# Altium schematic sheet fpga23-serdes-power.SchDoc
size Tabloid; SheetNumber: 52; SheetTotal: 71
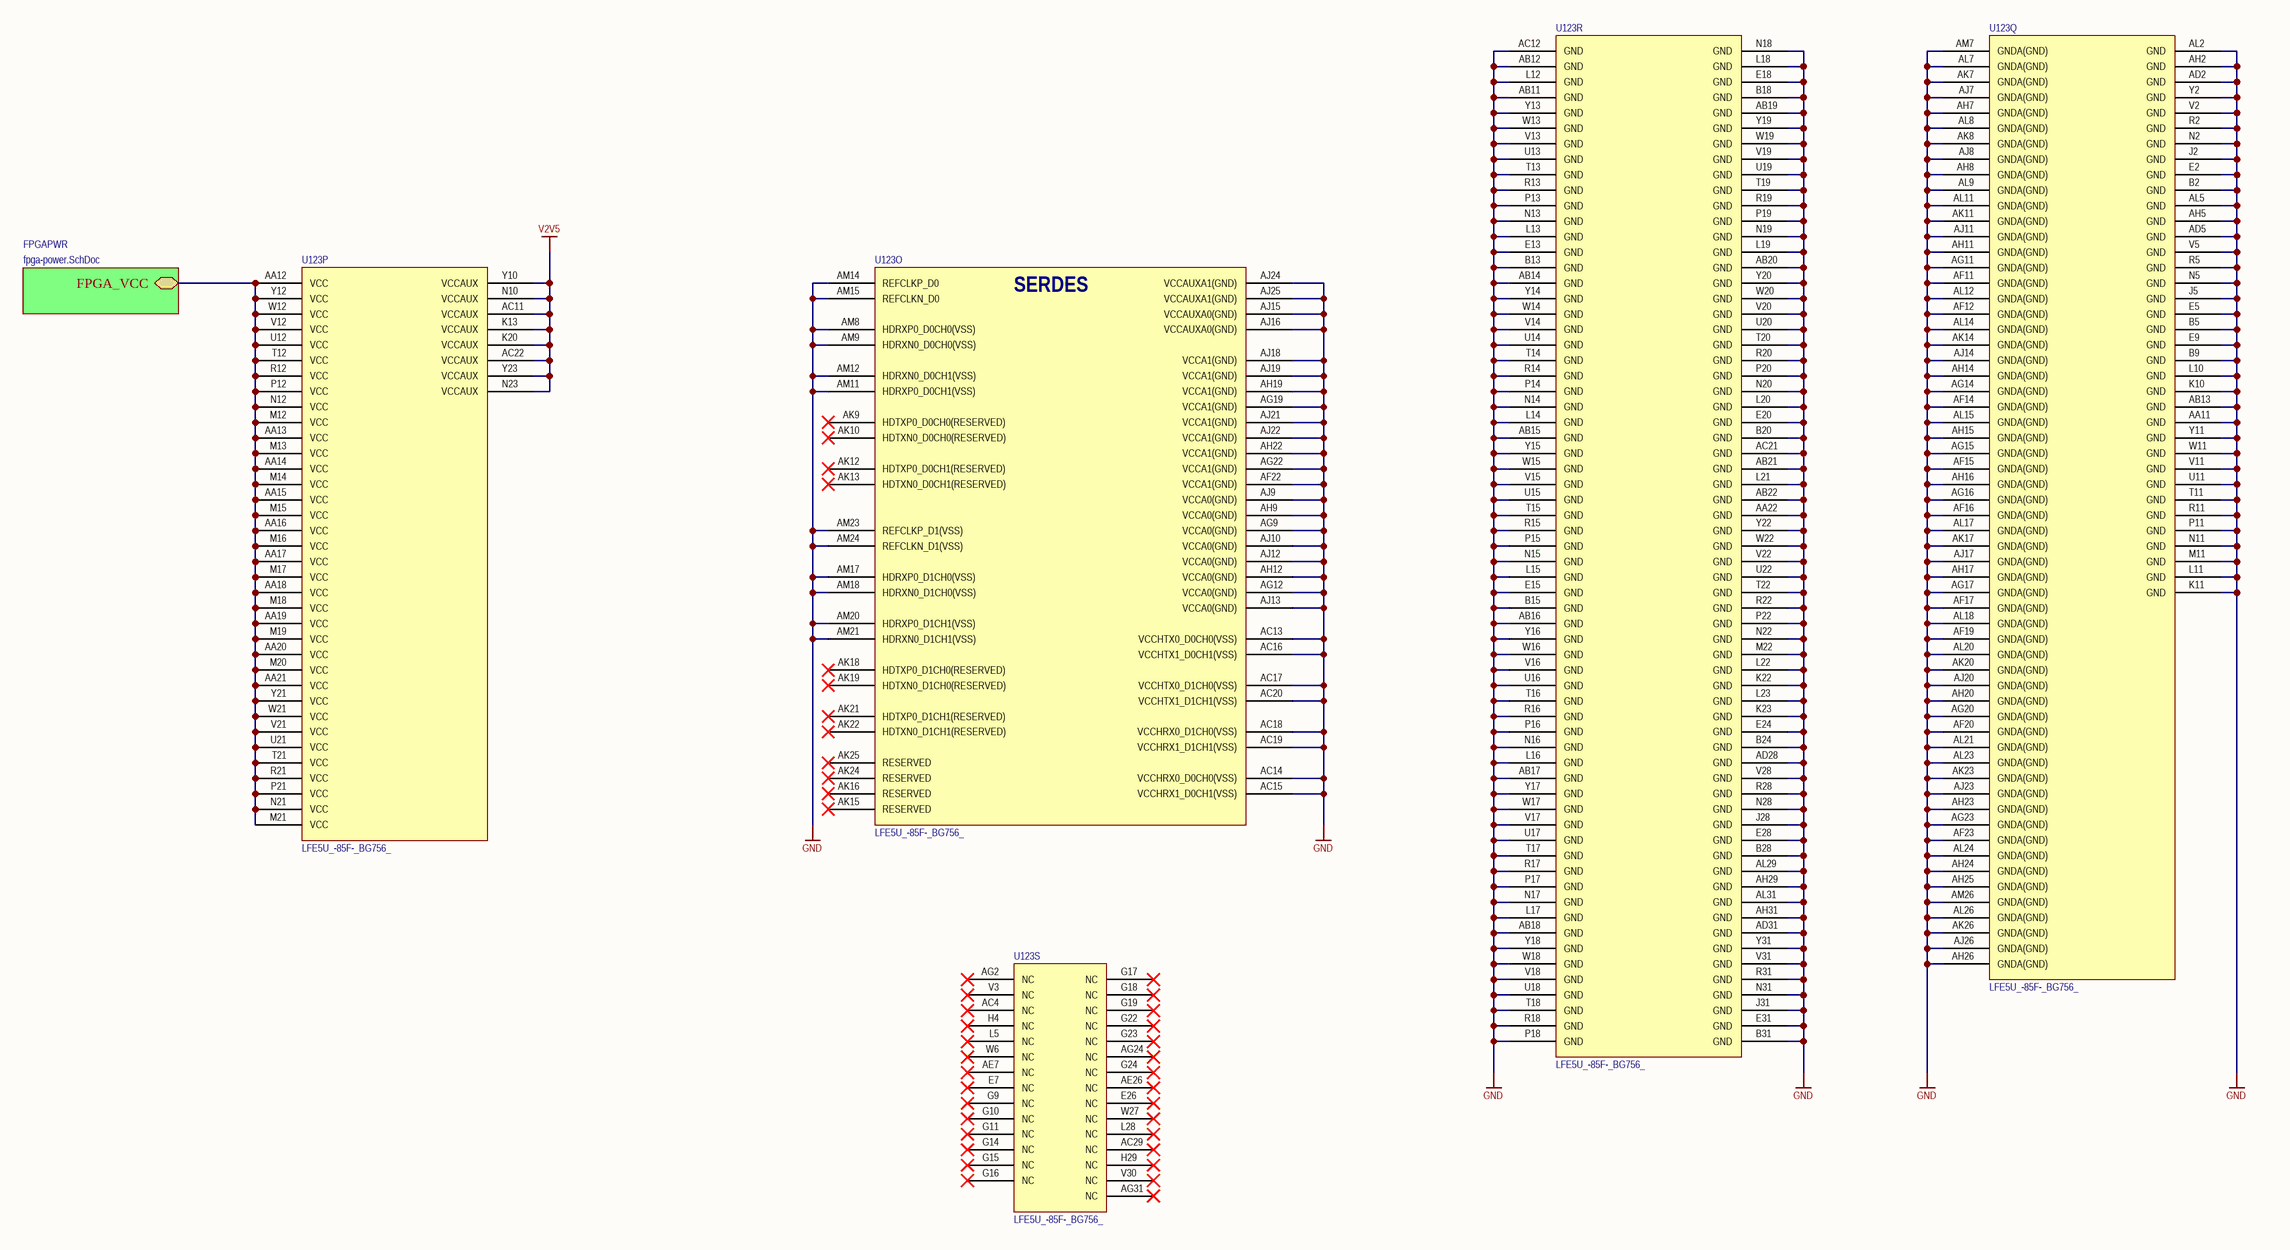
[diagram p0: fpga23-serdes-power.SchDoc]

## Parts
U123  LFE5U_-85F-_BG756_  [caBGA756]  (parts O,P,Q,R,S of 19)

## Sub-sheets
FPGAPWR = fpga-power.SchDoc: FPGA_VCC

## Nets
GND: U123.AA11(GND) U123.AA22(GND) U123.AB11(GND) U123.AB12(GND) U123.AB13(GND) U123.AB14(GND) U123.AB15(GND) U123.AB16(GND) U123.AB17(GND) U123.AB18(GND) U123.AB19(GND) U123.AB20(GND) U123.AB21(GND) U123.AB22(GND) U123.AC12(GND) U123.AC13(VCCHTX0_D0CH0(VSS)) U123.AC14(VCCHRX0_D0CH0(VSS)) U123.AC15(VCCHRX1_D0CH1(VSS)) U123.AC16(VCCHTX1_D0CH1(VSS)) U123.AC17(VCCHTX0_D1CH0(VSS)) U123.AC18(VCCHRX0_D1CH0(VSS)) U123.AC19(VCCHRX1_D1CH1(VSS)) U123.AC20(VCCHTX1_D1CH1(VSS)) U123.AC21(GND) U123.AD2(GND) U123.AD5(GND) U123.AD28(GND) U123.AD31(GND) U123.AF11(GNDA(GND)) U123.AF12(GNDA(GND)) U123.AF14(GNDA(GND)) U123.AF15(GNDA(GND)) U123.AF16(GNDA(GND)) U123.AF17(GNDA(GND)) U123.AF19(GNDA(GND)) U123.AF20(GNDA(GND)) U123.AF22(VCCA1(GND)) U123.AF23(GNDA(GND)) U123.AG9(VCCA0(GND)) U123.AG11(GNDA(GND)) U123.AG12(VCCA0(GND)) U123.AG14(GNDA(GND)) U123.AG15(GNDA(GND)) U123.AG16(GNDA(GND)) U123.AG17(GNDA(GND)) U123.AG19(VCCA1(GND)) U123.AG20(GNDA(GND)) U123.AG22(VCCA1(GND)) U123.AG23(GNDA(GND)) U123.AH2(GND) U123.AH5(GND) U123.AH7(GNDA(GND)) U123.AH8(GNDA(GND)) U123.AH9(VCCA0(GND)) U123.AH11(GNDA(GND)) U123.AH12(VCCA0(GND)) U123.AH14(GNDA(GND)) U123.AH15(GNDA(GND)) U123.AH16(GNDA(GND)) U123.AH17(GNDA(GND)) U123.AH19(VCCA1(GND)) U123.AH20(GNDA(GND)) U123.AH22(VCCA1(GND)) U123.AH23(GNDA(GND)) U123.AH24(GNDA(GND)) U123.AH25(GNDA(GND)) U123.AH26(GNDA(GND)) U123.AH29(GND) U123.AH31(GND) U123.AJ7(GNDA(GND)) U123.AJ8(GNDA(GND)) U123.AJ9(VCCA0(GND)) U123.AJ10(VCCA0(GND)) U123.AJ11(GNDA(GND)) U123.AJ12(VCCA0(GND)) U123.AJ13(VCCA0(GND)) U123.AJ14(GNDA(GND)) U123.AJ15(VCCAUXA0(GND)) U123.AJ16(VCCAUXA0(GND)) U123.AJ17(GNDA(GND)) U123.AJ18(VCCA1(GND)) U123.AJ19(VCCA1(GND)) U123.AJ20(GNDA(GND)) U123.AJ21(VCCA1(GND)) U123.AJ22(VCCA1(GND)) U123.AJ23(GNDA(GND)) U123.AJ24(VCCAUXA1(GND)) U123.AJ25(VCCAUXA1(GND)) U123.AJ26(GNDA(GND)) U123.AK7(GNDA(GND)) U123.AK8(GNDA(GND)) U123.AK11(GNDA(GND)) U123.AK14(GNDA(GND)) U123.AK17(GNDA(GND)) U123.AK20(GNDA(GND)) U123.AK23(GNDA(GND)) U123.AK26(GNDA(GND)) U123.AL2(GND) U123.AL5(GND) U123.AL7(GNDA(GND)) U123.AL8(GNDA(GND)) U123.AL9(GNDA(GND)) U123.AL11(GNDA(GND)) U123.AL12(GNDA(GND)) U123.AL14(GNDA(GND)) U123.AL15(GNDA(GND)) U123.AL17(GNDA(GND)) U123.AL18(GNDA(GND)) U123.AL20(GNDA(GND)) U123.AL21(GNDA(GND)) U123.AL23(GNDA(GND)) U123.AL24(GNDA(GND)) U123.AL26(GNDA(GND)) U123.AL29(GND) U123.AL31(GND) U123.AM7(GNDA(GND)) U123.AM8(HDRXP0_D0CH0(VSS)) U123.AM9(HDRXN0_D0CH0(VSS)) U123.AM11(HDRXP0_D0CH1(VSS)) U123.AM12(HDRXN0_D0CH1(VSS)) U123.AM14(REFCLKP_D0) U123.AM15(REFCLKN_D0) U123.AM17(HDRXP0_D1CH0(VSS)) U123.AM18(HDRXN0_D1CH0(VSS)) U123.AM20(HDRXP0_D1CH1(VSS)) U123.AM21(HDRXN0_D1CH1(VSS)) U123.AM23(REFCLKP_D1(VSS)) U123.AM24(REFCLKN_D1(VSS)) U123.AM26(GNDA(GND)) U123.B2(GND) U123.B5(GND) U123.B9(GND) U123.B13(GND) U123.B15(GND) U123.B18(GND) U123.B20(GND) U123.B24(GND) U123.B28(GND) U123.B31(GND) U123.E2(GND) U123.E5(GND) U123.E9(GND) U123.E13(GND) U123.E15(GND) U123.E18(GND) U123.E20(GND) U123.E24(GND) U123.E28(GND) U123.E31(GND) U123.J2(GND) U123.J5(GND) U123.J28(GND) U123.J31(GND) U123.K10(GND) U123.K11(GND) U123.K22(GND) U123.K23(GND) U123.L10(GND) U123.L11(GND) U123.L12(GND) U123.L13(GND) U123.L14(GND) U123.L15(GND) U123.L16(GND) U123.L17(GND) U123.L18(GND) U123.L19(GND) U123.L20(GND) U123.L21(GND) U123.L22(GND) U123.L23(GND) U123.M11(GND) U123.M22(GND) U123.N2(GND) U123.N5(GND) U123.N11(GND) U123.N13(GND) U123.N14(GND) U123.N15(GND) U123.N16(GND) U123.N17(GND) U123.N18(GND) U123.N19(GND) U123.N20(GND) U123.N22(GND) U123.N28(GND) U123.N31(GND) U123.P11(GND) U123.P13(GND) U123.P14(GND) U123.P15(GND) U123.P16(GND) U123.P17(GND) U123.P18(GND) U123.P19(GND) U123.P20(GND) U123.P22(GND) U123.R2(GND) U123.R5(GND) U123.R11(GND) U123.R13(GND) U123.R14(GND) U123.R15(GND) U123.R16(GND) U123.R17(GND) U123.R18(GND) U123.R19(GND) U123.R20(GND) U123.R22(GND) U123.R28(GND) U123.R31(GND) U123.T11(GND) U123.T13(GND) U123.T14(GND) U123.T15(GND) U123.T16(GND) U123.T17(GND) U123.T18(GND) U123.T19(GND) U123.T20(GND) U123.T22(GND) U123.U11(GND) U123.U13(GND) U123.U14(GND) U123.U15(GND) U123.U16(GND) U123.U17(GND) U123.U18(GND) U123.U19(GND) U123.U20(GND) U123.U22(GND) U123.V2(GND) U123.V5(GND) U123.V11(GND) U123.V13(GND) U123.V14(GND) U123.V15(GND) U123.V16(GND) U123.V17(GND) U123.V18(GND) U123.V19(GND) U123.V20(GND) U123.V22(GND) U123.V28(GND) U123.V31(GND) U123.W11(GND) U123.W13(GND) U123.W14(GND) U123.W15(GND) U123.W16(GND) U123.W17(GND) U123.W18(GND) U123.W19(GND) U123.W20(GND) U123.W22(GND) U123.Y2(GND) U123.Y11(GND) U123.Y13(GND) U123.Y14(GND) U123.Y15(GND) U123.Y16(GND) U123.Y17(GND) U123.Y18(GND) U123.Y19(GND) U123.Y20(GND) U123.Y22(GND) U123.Y31(GND)
V2V5: U123.AC11(VCCAUX) U123.AC22(VCCAUX) U123.K13(VCCAUX) U123.K20(VCCAUX) U123.N10(VCCAUX) U123.N23(VCCAUX) U123.Y10(VCCAUX) U123.Y23(VCCAUX)
NetU123_AA12: U123.AA12(VCC) U123.AA13(VCC) U123.AA14(VCC) U123.AA15(VCC) U123.AA16(VCC) U123.AA17(VCC) U123.AA18(VCC) U123.AA19(VCC) U123.AA20(VCC) U123.AA21(VCC) U123.M12(VCC) U123.M13(VCC) U123.M14(VCC) U123.M15(VCC) U123.M16(VCC) U123.M17(VCC) U123.M18(VCC) U123.M19(VCC) U123.M20(VCC) U123.M21(VCC) U123.N12(VCC) U123.N21(VCC) U123.P12(VCC) U123.P21(VCC) U123.R12(VCC) U123.R21(VCC) U123.T12(VCC) U123.T21(VCC) U123.U12(VCC) U123.U21(VCC) U123.V12(VCC) U123.V21(VCC) U123.W12(VCC) U123.W21(VCC) U123.Y12(VCC) U123.Y21(VCC) ; sheet FPGAPWR/FPGA_VCC

Not connected (* = marked no-connect by the designer): U123 AC4(NC)* AC29(NC)* AE7(NC)* AE26(NC)* AG2(NC)* AG24(NC)* AG31(NC)* AK9(HDTXP0_D0CH0(RESERVED))* AK10(HDTXN0_D0CH0(RESERVED))* AK12(HDTXP0_D0CH1(RESERVED))* AK13(HDTXN0_D0CH1(RESERVED))* AK15(RESERVED)* AK16(RESERVED)* AK18(HDTXP0_D1CH0(RESERVED))* AK19(HDTXN0_D1CH0(RESERVED))* AK21(HDTXP0_D1CH1(RESERVED))* AK22(HDTXN0_D1CH1(RESERVED))* AK24(RESERVED)* AK25(RESERVED)* E7(NC)* E26(NC)* G9(NC)* G10(NC)* G11(NC)* G14(NC)* G15(NC)* G16(NC)* G17(NC)* G18(NC)* G19(NC)* G22(NC)* G23(NC)* G24(NC)* H4(NC)* H29(NC)* L5(NC)* L28(NC)* V3(NC)* V30(NC)* W6(NC)* W27(NC)*

## Notes on the sheet
- (in symbol LFE5U_-85F-_BG756_, part O) SERDES

## Library data of the parts
U123 = LFE5U_-85F-_BG756_: ECP5 FPGA, 85k LUT, 756-caBGA; Manufacturer: Lattice Semiconductor; Manufacturer P/N: LFE5U_-85F-_BG756_